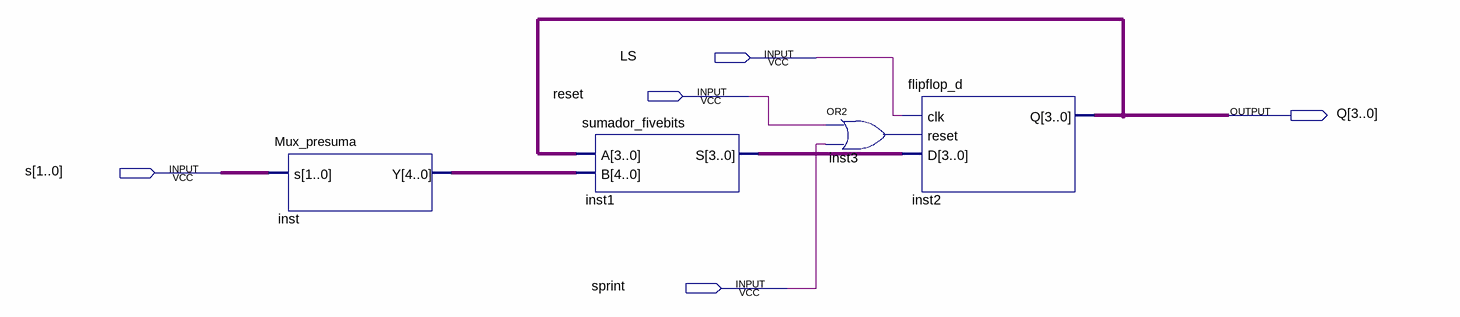
[diagram p0: schematic sheet]
// Quartus schematic Posicion.bdf as structural Verilog: 4 symbols, 5 pins
module Posicion (
  input  LS,
  input  reset,
  input  [1:0] s,
  input  sprint,
  output [3:0] Q
);

  wire inst3_out;
  wire [3:0] inst1_s;
  wire [4:0] inst_y;

  Mux_presuma inst (.s(s), .Y(inst_y));
  sumador_fivebits inst1 (.A(Q), .B(inst_y), .S(inst1_s));
  or inst3 (inst3_out, reset, sprint);
  flipflop_d inst2 (.clk(LS), .reset(inst3_out), .D(inst1_s), .Q(Q));
endmodule
